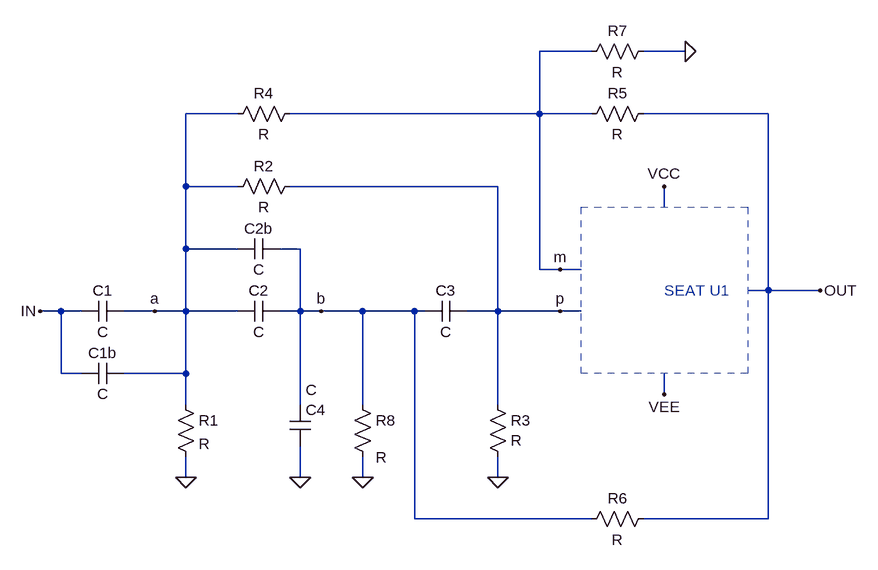
[diagram p0: schematic SK_HP.asc]
SK_HP.asc, the LTspice schematic file:
Version 4.1
SHEET 1 2076 912
WIRE 144 -112 64 -112
WIRE 288 -112 224 -112
WIRE -400 -16 -480 -16
WIRE 64 -16 64 -112
WIRE 64 -16 -320 -16
WIRE 144 -16 64 -16
WIRE 416 -16 224 -16
WIRE -480 96 -480 -16
WIRE -400 96 -480 96
WIRE 0 96 -320 96
WIRE 256 128 256 96
WIRE -480 192 -480 96
WIRE -400 192 -480 192
WIRE -304 192 -336 192
WIRE 64 224 64 -16
WIRE 96 224 64 224
WIRE 128 224 96 224
WIRE 416 256 416 -16
WIRE 416 256 384 256
WIRE 496 256 416 256
WIRE -672 288 -704 288
WIRE -640 288 -672 288
WIRE -528 288 -576 288
WIRE -480 288 -480 192
WIRE -480 288 -528 288
WIRE -400 288 -480 288
WIRE -304 288 -304 192
WIRE -304 288 -336 288
WIRE -272 288 -304 288
WIRE -208 288 -272 288
WIRE -128 288 -208 288
WIRE -112 288 -128 288
WIRE 0 288 0 96
WIRE 0 288 -48 288
WIRE 96 288 0 288
WIRE 128 288 96 288
WIRE -672 384 -672 288
WIRE -640 384 -672 384
WIRE -480 384 -480 288
WIRE -480 384 -576 384
WIRE 256 416 256 384
WIRE -480 432 -480 384
WIRE -304 432 -304 288
WIRE -208 432 -208 288
WIRE 0 432 0 288
WIRE -480 544 -480 512
WIRE -304 544 -304 496
WIRE -208 544 -208 512
WIRE 0 544 0 512
WIRE -128 608 -128 288
WIRE 144 608 -128 608
WIRE 416 608 416 256
WIRE 416 608 224 608
FLAG 496 256 OUT
FLAG 256 96 VCC
FLAG 256 416 VEE
FLAG 96 224 m
FLAG 96 288 p
FLAG -528 288 a
FLAG -704 288 IN
FLAG -272 288 b
FLAG -208 544 0
FLAG 288 -112 0
FLAG -480 544 0
FLAG 0 544 0
FLAG -304 544 0
SYMBOL res -496 416 R0
SYMATTR InstName R1
SYMBOL res -304 80 R90
WINDOW 0 0 56 VBottom 2
WINDOW 3 32 56 VTop 2
SYMATTR InstName R2
SYMBOL res -16 416 R0
WINDOW 3 36 71 Left 2
SYMATTR InstName R3
SYMBOL res -304 -32 R90
WINDOW 0 0 56 VBottom 2
WINDOW 3 32 56 VTop 2
SYMATTR InstName R4
SYMBOL res 240 -32 R90
WINDOW 0 0 56 VBottom 2
WINDOW 3 32 56 VTop 2
SYMATTR InstName R5
SYMBOL res 240 -128 R90
WINDOW 0 0 56 VBottom 2
WINDOW 3 32 56 VTop 2
SYMATTR InstName R7
SYMBOL res -224 416 R0
WINDOW 3 36 97 Left 2
SYMATTR InstName R8
SYMBOL cap -576 272 R90
WINDOW 0 0 32 VBottom 2
WINDOW 3 32 32 VTop 2
SYMATTR InstName C1
SYMBOL cap -336 272 R90
WINDOW 0 0 32 VBottom 2
WINDOW 3 32 32 VTop 2
SYMATTR InstName C2
SYMBOL cap -112 304 R270
WINDOW 0 32 32 VTop 2
WINDOW 3 0 32 VBottom 2
SYMATTR InstName C3
SYMBOL cap -320 432 R0
WINDOW 3 24 -23 Left 2
SYMATTR InstName C4
SYMBOL cap -576 368 R90
WINDOW 3 32 32 VTop 2
WINDOW 0 0 32 VBottom 2
SYMATTR InstName C1b
SYMBOL cap -336 176 R90
WINDOW 0 0 32 VBottom 2
WINDOW 3 32 32 VTop 2
SYMATTR InstName C2b
SYMBOL res 240 592 R90
WINDOW 0 0 56 VBottom 2
WINDOW 3 32 56 VTop 2
SYMATTR InstName R6
TEXT 256 256 Left 2 ;SEAT U1
RECTANGLE Normal 128 128 384 384 2

The netlist it stands for:
* SK_HP.asc
R1 a 0 R
R2 p a R
R3 p 0 R
R4 m a R
R5 OUT m R
R7 0 m R
R8 b 0 R
C1 a IN C
C2 b a C
C3 b p C
C4 b 0 C
C1b a IN C
C2b b a C
R6 OUT b R
* SEAT U1
.backanno
.end